# EAGLE design SiPM (EAGLE 9.5.2)
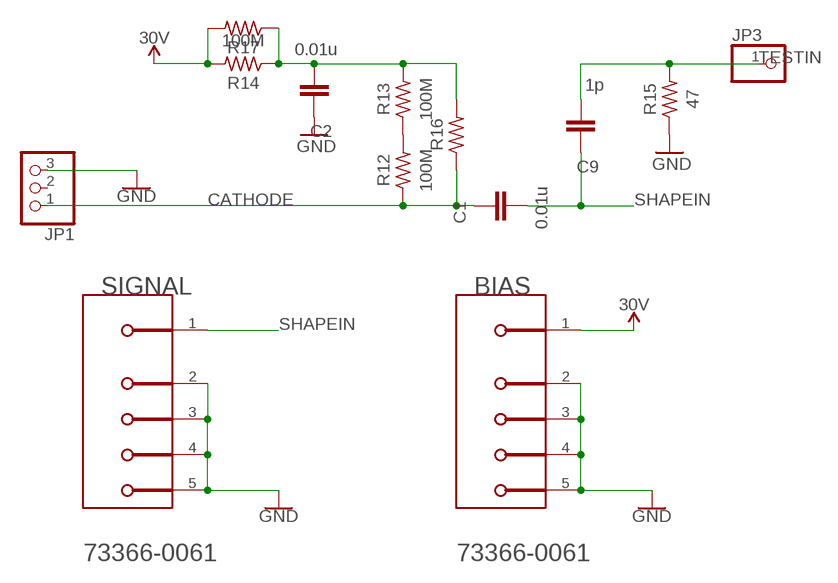
[diagram p0: schematic, sheet 1]

## Parts
BIAS  MOLEX_73366-0061MOLEX_73366-0061_0_0  [MOLEX_73366-0061_0]
C1  0.01u  GRM31CR60J107ME39L  [CAP_1206]
C2  0.01u  GRM31CR60J107ME39L  [CAP_1206]
C9  1p  GRM31CR60J107ME39L  [CAP_1206]
JP1  PINHD-1X3  [1X03]
JP3  PINHD-1X1  [1X01]
R12  100M  R-US_AXIAL-11.7MM-PITCH  [RESAD1176W63L850D250B]
R13  100M  R-US_AXIAL-11.7MM-PITCH  [RESAD1176W63L850D250B]
R14  100M  R-US_AXIAL-11.7MM-PITCH  [RESAD1176W63L850D250B]
R15  47  R-US_AXIAL-11.7MM-PITCH  [RESAD1176W63L850D250B]
R16  R-US_AXIAL-11.7MM-PITCH  [RESAD1176W63L850D250B]
R17  R-US_AXIAL-11.7MM-PITCH  [RESAD1176W63L850D250B]
SIGNAL  MOLEX_73366-0061MOLEX_73366-0061_0_0  [MOLEX_73366-0061_0]

## Nets
CATHODE: C1.1 JP1.1 R12.1 R16.1
GND: BIAS.2(MNT_1) BIAS.3(MNT_2) BIAS.4(MNT_3) BIAS.5(MNT_4) C2.1 JP1.3 R15.1 SIGNAL.2(MNT_1) SIGNAL.3(MNT_2) SIGNAL.4(MNT_3) SIGNAL.5(MNT_4)
N$3: R12.2 R13.1
N$4: C2.2 R13.2 R14.1 R16.2 R17.1
SHAPEIN: C1.2 C9.1 SIGNAL.1
TESTIN: C9.2 JP3.1 R15.2
VIN: BIAS.1 R14.2 R17.2 ; supply symbol labelled 30V
Unconnected: JP1.2

## Library data of the parts
BIAS SIGNAL = Molex - 73366-0061:MOLEX_73366-0061: MCX Connector Jack, Female Socket 50Ohm Through Hole Solder; AUTOMOTIVE: No; CENTROID_NOT_SPECIFIED: No; CONN_ORIENTATION: Straight; CONTACT_MATERIAL: Gold,Nickel; DATASHEET: https://www.molex.com/webdocs/datasheets/pdf/en-us/0733660061_RF_COAX_CONNECTORS.pdf; DEVICE_CLASS_L1: Connectors; DEVICE_CLASS_L2: RF / Coaxial Connectors; DEVICE_CLASS_L3: unset; DIELECTRIC_MATERIAL: PTFE; DIGIKEY_DESCRIPTION: CONN MCX JACK STR 50 OHM PCB; DIGIKEY_PART_NUMBER: WM5541-ND; FOOTPRINT_URL: https://www.molex.com/pdm_docs/sd/733660061_sd.pdf; FOOTPRINT_VARIANT_NAME_0: Recommended_Land_Pattern; FREQUENCY: 6GHz; HEIGHT: 5.23mm; IMPEDANCE: 50Ω; IS_FEMALE: yes; LEAD_FREE: Yes; MF: Molex; MFG_PACKAGE_IDENT: 0; MFG_PACKAGE_IDENT_DATE: 0; MFG_PACKAGE_IDENT_REV: 0; MOUSER_DESCRIPTION: RF Connectors / Coaxial Connectors MCX PCB JACK; MOUSER_PART_NUMBER: 538-73366-0061; MPN: 73366-0061; NUMBER_OF_CONTACTS: 1; PACKAGE: CONN_JACK; PREFIX: J; ROHS: Yes; SHIELDING: true; STANDOFF_HEIGHT: 0.05mm; TEMPERATURE_RANGE_HIGH: +155°C; TEMPERATURE_RANGE_LOW: -55°C; VERIFICATION_VERSION: 0.0.0.3; VOLTAGE_RATING: 335V
C1 C2 C9 = Resistor_Capacitor:GRM31CR60J107ME39L: CAP CER 100UF 6.3V X5R 1206 Manufacturer's datasheet <https://www.murata.com/~/media/webrenewal/support/library/catalog/products/capacitor/mlcc/c02e.ashx?la=en-us>; CREATED_BY: PCBLayout.com; DIGIKEY_PART_NUMBER: GRM31CR60J107ME39L; MANUFACTURER: Murata Electronics North America; MPN: GRM31CR60J107ME39L; PACKAGE: SMD 1206
JP1 = pinhead:PINHD-1X3: PIN HEADER
JP3 = pinhead:PINHD-1X1: PIN HEADER
R12-R17 = Resistor:R-US: Resistor Fixed - ANSI; CATEGORY: Resistor; SUB-CATEGORY: Fixed

## Board
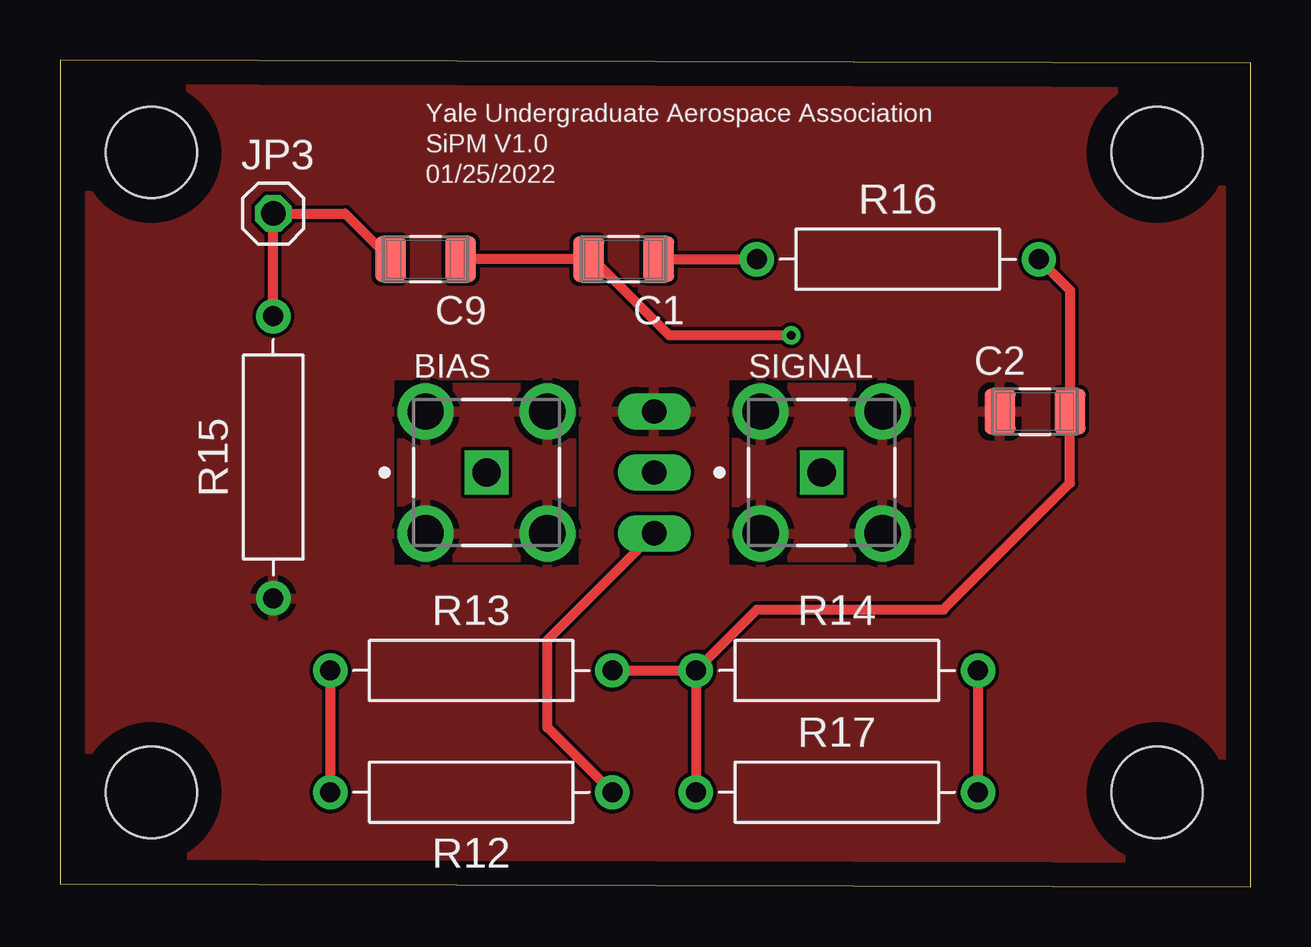
[diagram p1: board, top side]
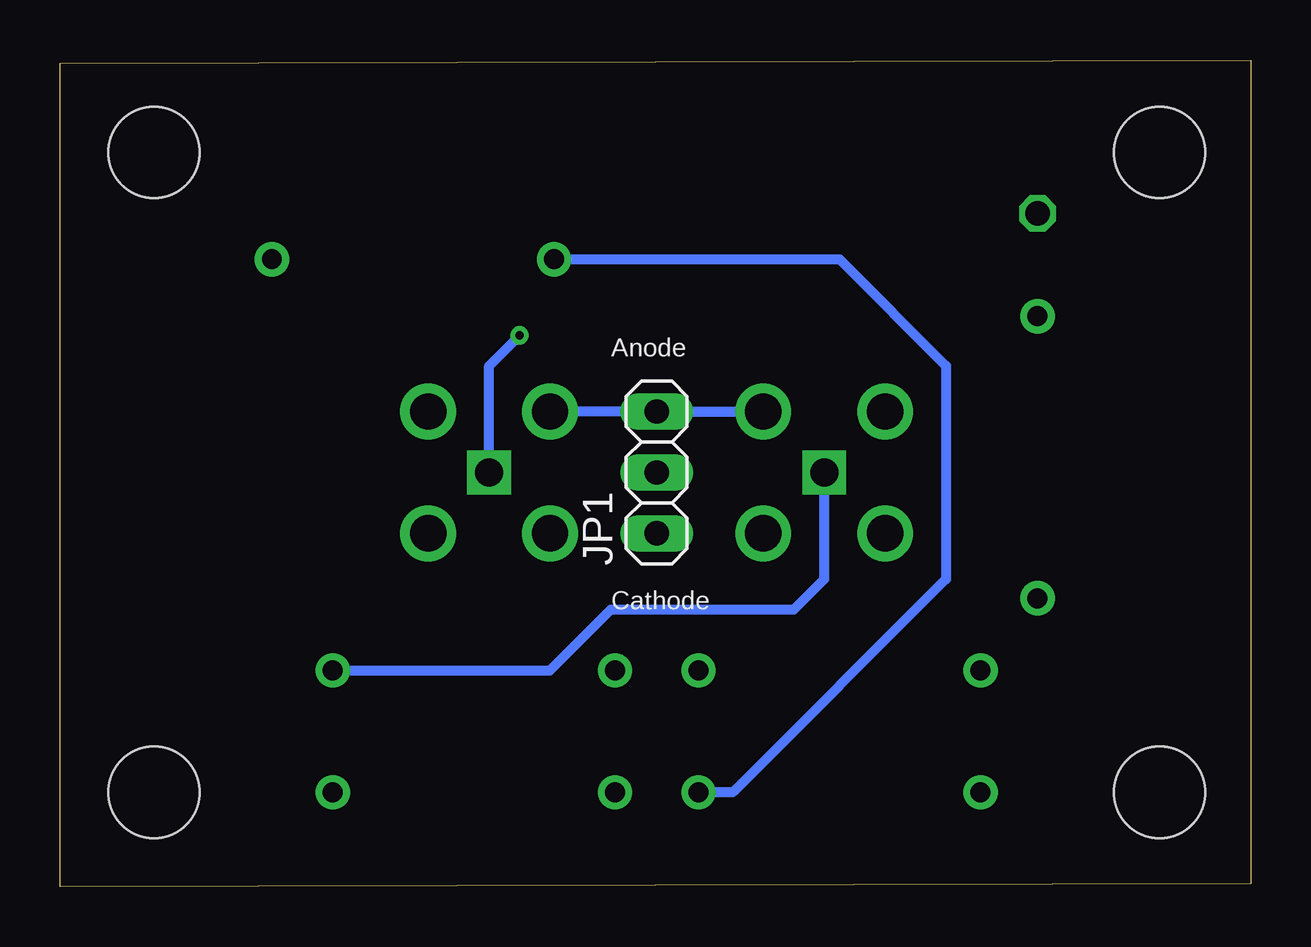
[diagram p2: board, bottom side, seen from below]

Size 49.64 x 34.47 mm. Coordinates in mm from the lower left corner, seen from the top.
Outline: 0,0.13 49.64,0 49.64,34.34 0,34.47 0,0.13
Copper layers (1*16): Top 0.035mm / dielectric 1.5mm / Bottom 0.035mm
Design rules "default": minimum track width 6mil, minimum drill 0.35mm, track to track 6mil, track to pad 6mil, pad to pad 6mil, via to via 6mil, smd to smd 6mil, copper to edge 40mil, drill to drill 6mil, minimum pad ring 10mil, minimum via ring 8mil, stop-mask expansion 4mil, vias tented up to drill 0mil, thermal gap 10mil
Holes 3.8 mm at 3.81,3.94 45.72,3.94 3.81,30.61 45.72,30.61

### Footprints (pad centres in the part's own frame; a part is rotated, then mirrored left to right if it is on the bottom)
MOLEX_73366-0061_0 = drill 1.17 pad 1.82 square: 1 0,0 | drill 1.52 pad 2.32: 2 -2.54,2.54; 3 2.54,2.54; 4 -2.54,-2.54; 5 2.54,-2.54
CAP_1206 = smd 1.29 x 1.91: 1 -1.46,0; 2 1.46,0
1X03 = drill 1.016 long: 1 -2.54,0; 2 0,0; 3 2.54,0
1X01 = drill 1.016 octagon: 1 0,0
RESAD1176W63L850D250B = drill 0.83 pad 1.43: 1 -5.88,0; 2 5.88,0

### Placement (x,y rotation side)
BIAS  17.78,17.27 0 top
C1  23.49,26.16 180 top
C2  40.64,19.81 0 top
C9  15.24,26.16 180 top
JP1  24.76,17.27 90 bottom
JP3  8.89,28.07 0 top
R12  17.15,3.94 180 top
R13  17.15,9.02 0 top
R14  32.38,9.02 0 top
R15  8.89,17.91 90 top
R16  34.93,26.16 0 top
R17  32.38,3.94 0 top
SIGNAL  31.75,17.27 0 top

### Tracks (layer width: path | path; a pad name or v marks a point on that pad's centre or on a via)
CATHODE
  Top 0.406: R12.1 20.32,6.64 20.32,10.29 JP1.1 | C1.1 R16.1
  Bottom 0.406: R16.1 17.15,26.16 12.7,21.72 12.7,12.83 21.59,3.94 R12.1
GND
  Bottom 0.406: SIGNAL.2 JP1.3 BIAS.3
  pour Top: 0,34.42 0,0.13 49.53,0.13 49.53,34.42
N$3
  Top 0.406: R13.1 R12.2
N$4
  Top 0.406: R13.2 R14.1 | R14.1 R17.1 | R14.1 29.04,11.56 36.83,11.56 42.1,16.83 C2.2 42.1,24.87 R16.2
SHAPEIN  (via drill 0.35)
  Top 0.406: C9.1 C1.2 22.23,26.16 25.4,22.99 v30.48,22.99
  Bottom 0.406: SIGNAL.1 31.75,21.72 v30.48,22.99
TESTIN
  Top 0.406: C9.2 11.88,28.07 JP3.1 R15.2
VIN
  Top 0.406: R14.2 R17.2
  Bottom 0.406: R14.2 29.21,9.02 26.67,11.56 19.05,11.56 17.78,12.83 BIAS.1

### Text on the board
tPlace: Yale Undergraduate Aerospace Association | SiPM V1.0 | 01/25/2022
bPlace: Anode | Cathode